# EAGLE design tdt_rereference (EAGLE 8.1.0)
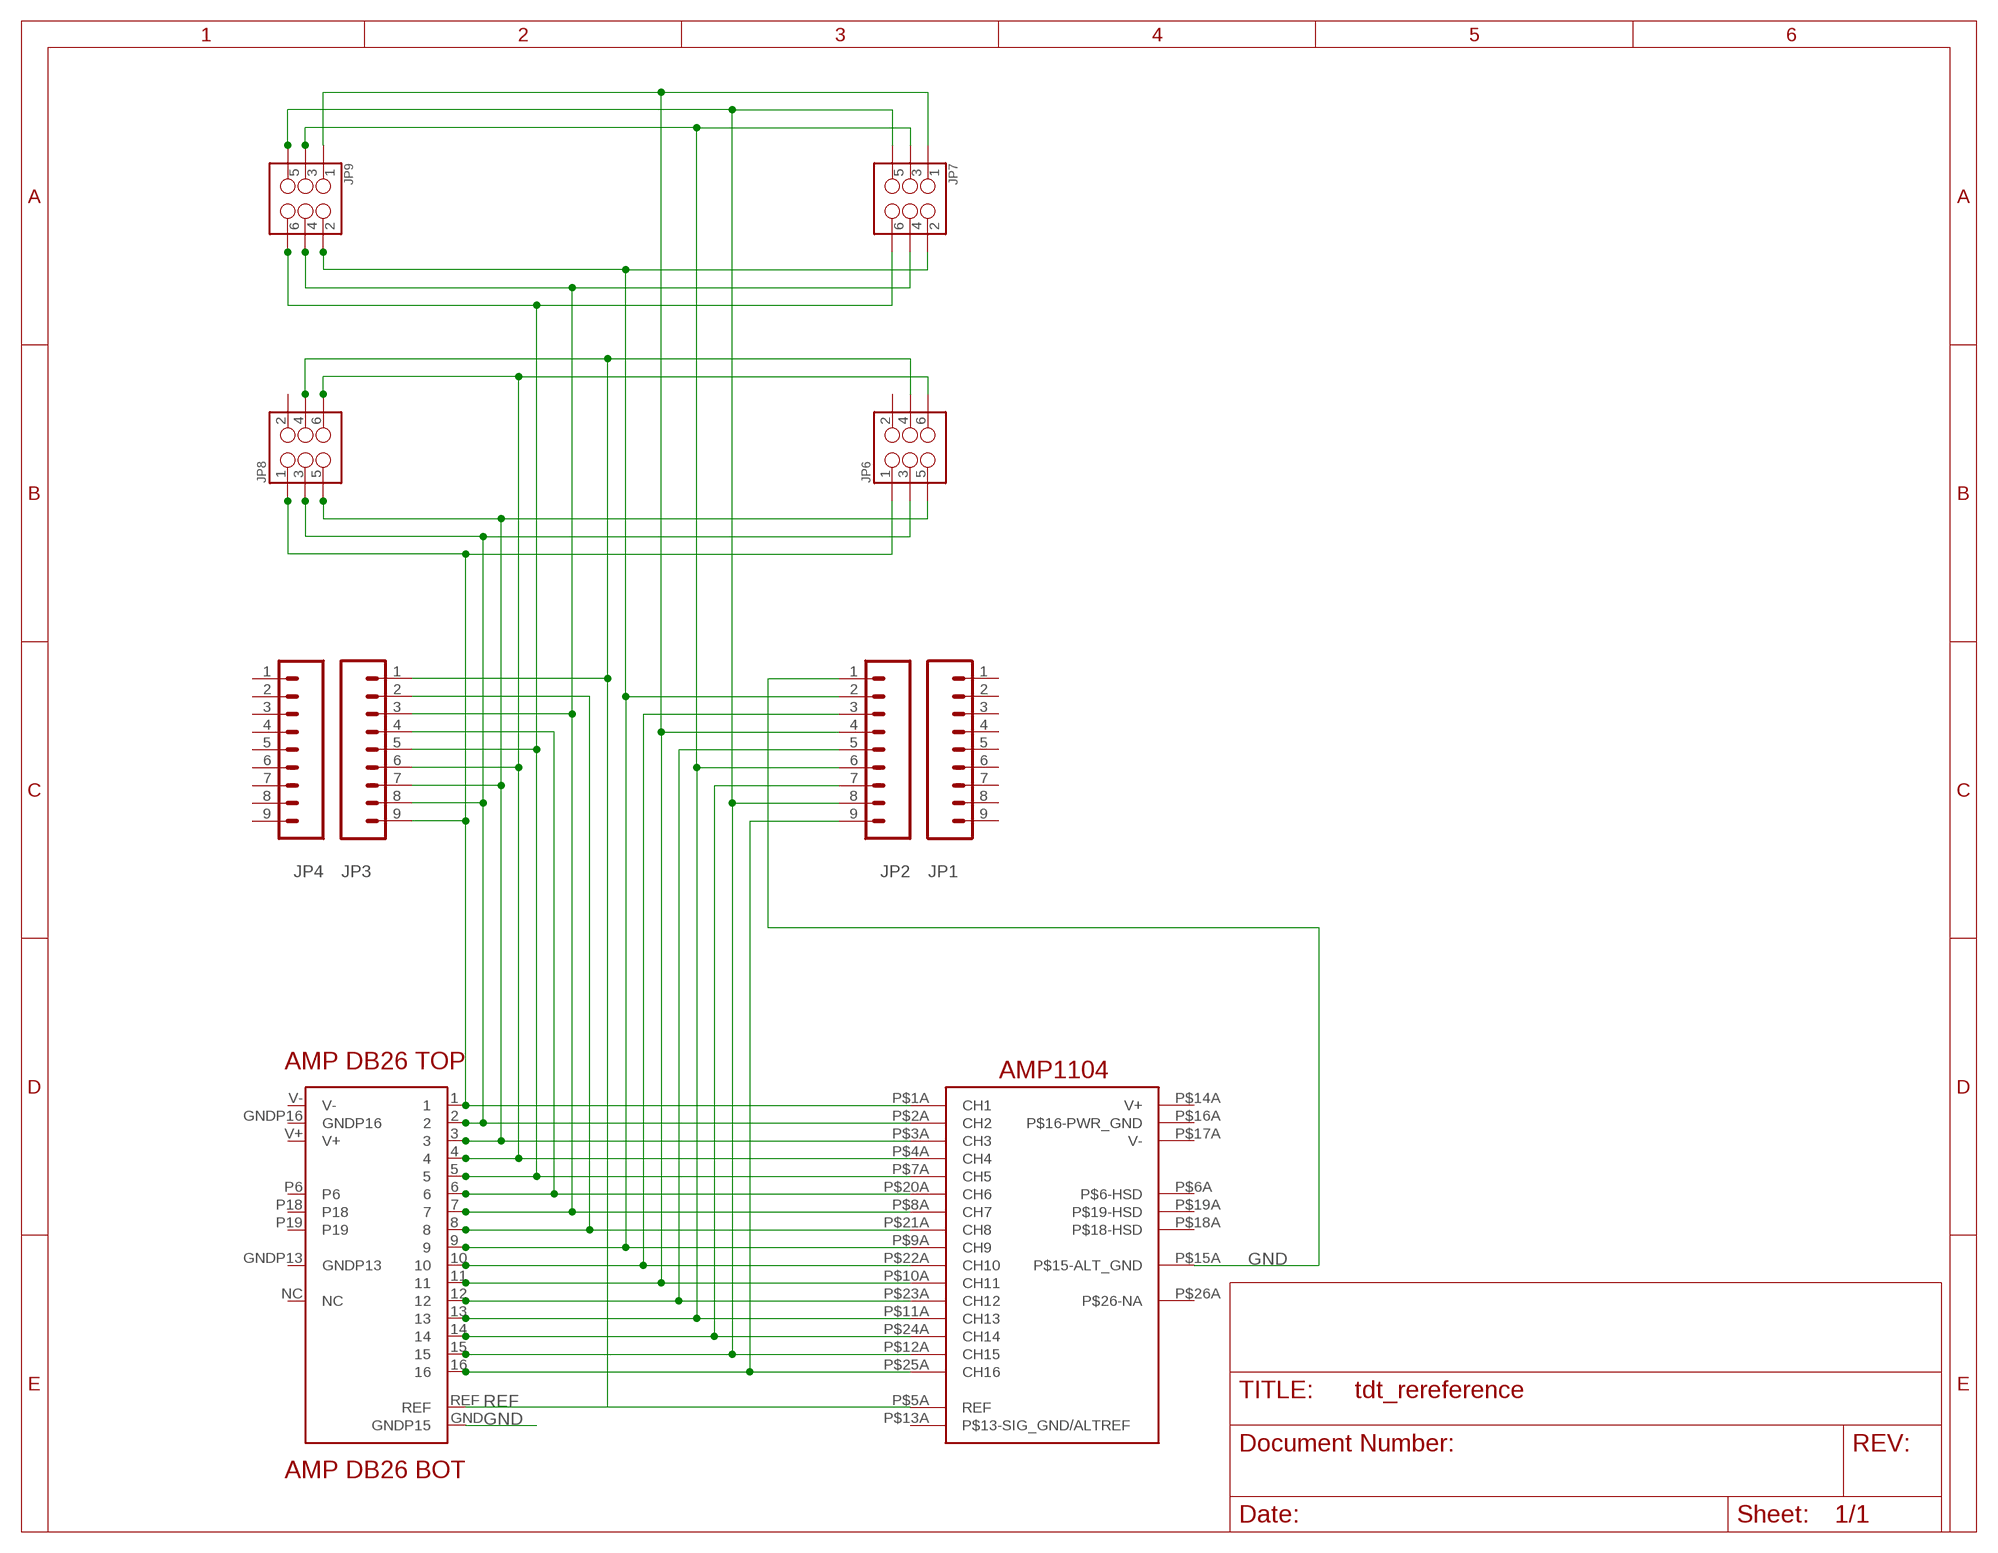
[diagram p0: schematic, sheet 1]

## Parts
JP1  M09  [1X09]
JP2  M09  [1X09]
JP3  M09  [1X09]
JP4  M09  [1X09]
JP6  M03X22X3_SILK_MALE_PTH  [2X3]
JP7  M03X22X3_SILK_MALE_PTH  [2X3]
JP8  M03X22X3_SILK_MALE_PTH  [2X3]
JP9  M03X22X3_SILK_MALE_PTH  [2X3]
U$1  DB26-MALE-BOT  [DB26-MALE-BOT]
U$2  DB26-MALE-TOP  [DB26-MALE-TOP]
U$3  AMP1104  [AMP1104]

## Nets
GND: JP2.1 U$1.GND(GNDP15) U$3.P$15A(P$15-ALT_GND)
N$1: JP3.9 JP6.1 JP8.1 U$2.1 U$3.P$1A(CH1)
N$2: JP3.8 JP6.3 JP8.3 U$2.2 U$3.P$2A(CH2)
N$3: JP3.7 JP6.5 JP8.5 U$2.3 U$3.P$3A(CH3)
N$4: JP3.6 JP6.6 JP8.6 U$2.4 U$3.P$4A(CH4)
N$5: JP3.5 JP7.6 JP9.6 U$2.5 U$3.P$7A(CH5)
N$6: JP3.4 U$1.6 U$3.P$20A(CH6)
N$7: JP3.3 JP7.4 JP9.4 U$2.7 U$3.P$8A(CH7)
N$8: JP3.2 U$1.8 U$3.P$21A(CH8)
N$9: JP2.2 JP7.2 JP9.2 U$2.9 U$3.P$9A(CH9)
N$11: JP2.4 JP7.1 JP9.1 U$2.11 U$3.P$10A(CH11)
N$12: JP2.5 U$1.12 U$3.P$23A(CH12)
N$13: JP2.6 JP7.3 JP9.3 U$2.13 U$3.P$11A(CH13)
N$14: JP2.7 U$1.14 U$3.P$24A(CH14)
N$15: JP2.8 JP7.5 JP9.5 U$2.15 U$3.P$12A(CH15)
N$16: JP2.9 U$1.16 U$3.P$25A(CH16)
N$17: JP2.3 U$1.10 U$3.P$22A(CH10)
REF: JP3.1 JP6.4 JP8.4 U$2.REF U$3.P$5A(REF)
Unconnected: JP1.1 JP1.2 JP1.3 JP1.4 JP1.5 JP1.6 JP1.7 JP1.8 JP1.9 JP4.1 JP4.2 JP4.3 JP4.4 JP4.5 JP4.6 JP4.7 JP4.8 JP4.9 JP6.2 JP8.2 U$1.GNDP16 U$1.NC U$1.P18 U$1.P19 U$1.V+ U$1.V- U$2.GNDP13 U$2.P6 U$3.P$6A(P$6-HSD) U$3.P$13A(P$13-SIG_GND/ALTREF) U$3.P$14A(V+) U$3.P$16A(P$16-PWR_GND) U$3.P$17A(V-) U$3.P$18A(P$18-HSD) U$3.P$19A(P$19-HSD) U$3.P$26A(P$26-NA)

## Library data of the parts
JP1-JP4 = SparkFun-Connectors:M09: Header 9 Standard 9-pin 0.1" header. Use with straight break away headers (SKU : PRT-00116), right angle break away headers (PRT-00553), swiss pins (PRT-00743), machine pins (PRT-00117), and female headers (PRT-00115).
JP6-JP9 = SparkFun-Connectors:M03X2: 2x3 .1" header. Shrouded, with keying- CONN-10681 SMT- CONN-11415 Pogo pins- HW-11044; PROD_ID: CONN-09701
U$1 = HDMI-DB26:DB26-MALE-BOT
U$2 = HDMI-DB26:DB26-MALE-TOP
U$3 = TDTCableConnector:AMP1104

## Board
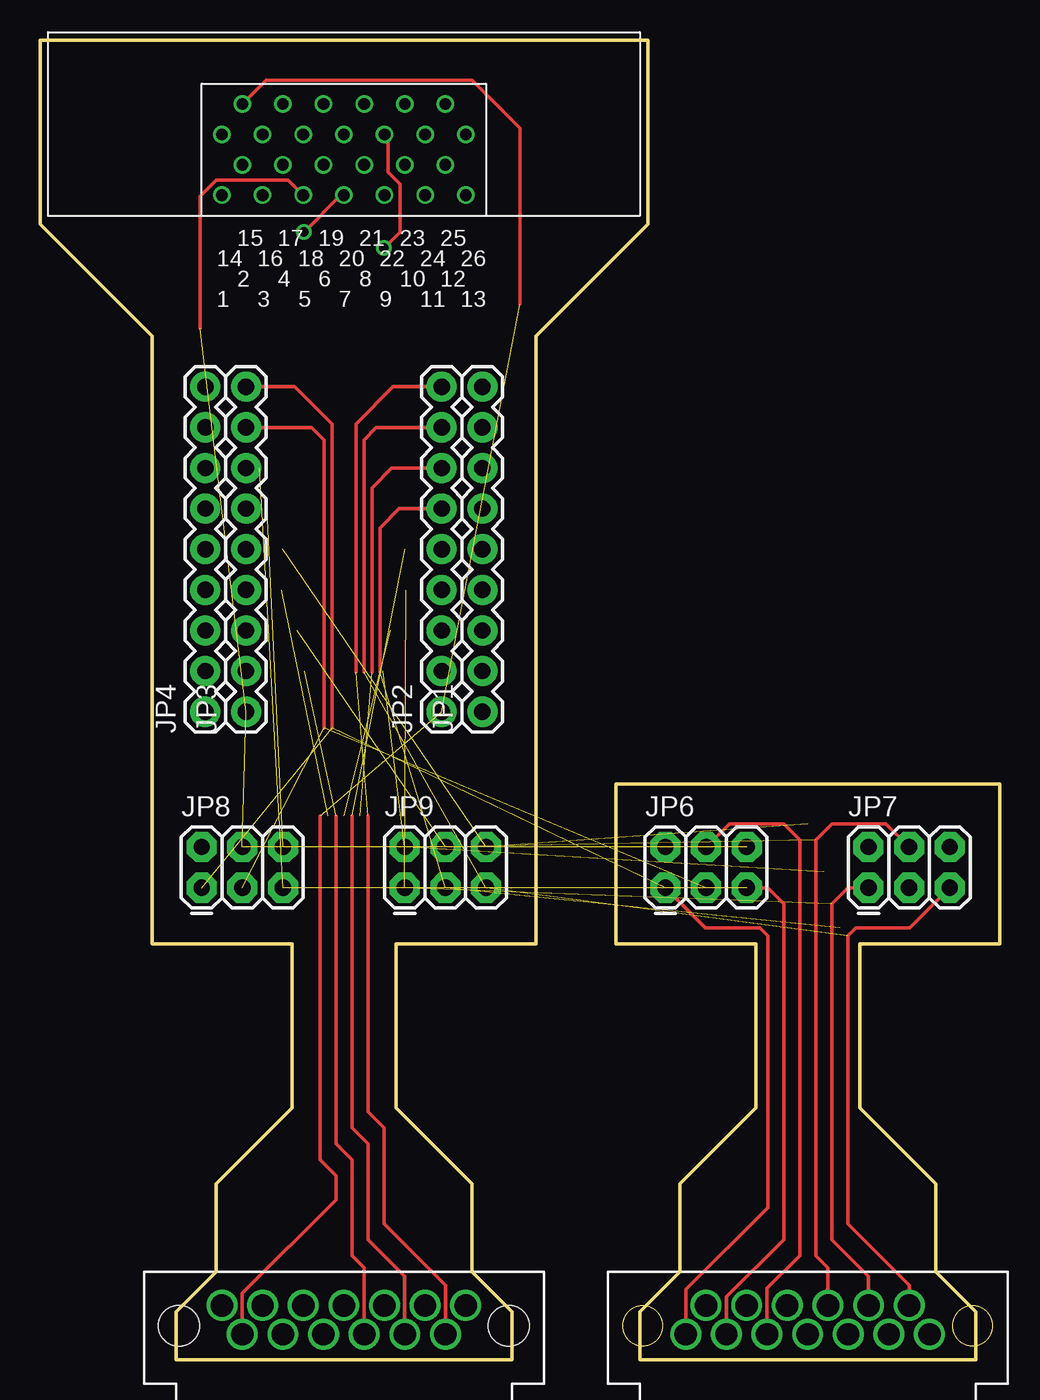
[diagram p1: board, top side]
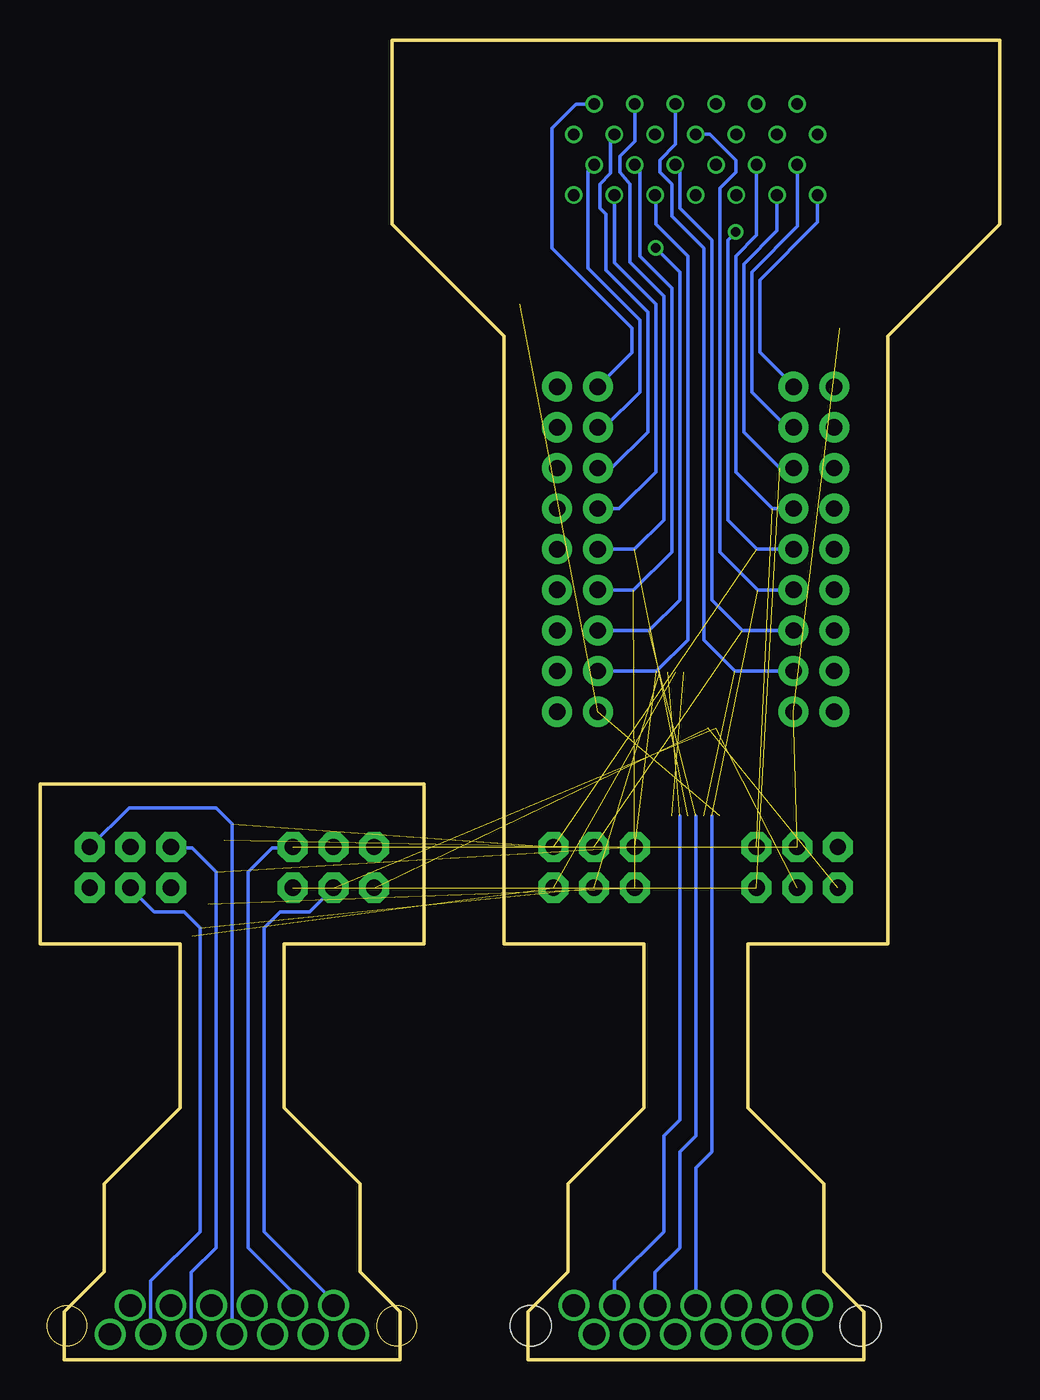
[diagram p2: board, bottom side, seen from below]

Size 60 x 82.5 mm. Coordinates in mm from the lower left corner, seen from the top.
Outline: 31,26 31,64 38,71 38,82.5 0,82.5 0,71 7,64 7,26 15.75,26 15.75,15.75 11,11 11,5.5 8.5,3 8.5,0 29.5,0 29.5,3 27,5.5 27,11 22.25,15.75 22.25,26 31,26
Outline: 58.5,0 37.5,0 37.5,3 40,5.5 40,11 44.75,15.75 44.75,26 36,26 36,36 60,36 60,26 51.25,26 51.25,15.75 56,11 56,5.5 58.5,3 58.5,0
Copper layers (1*16): Top 0.0356mm / dielectric 1.5011mm / Bottom 0.0356mm
Design rules "oshpark-2layer *": minimum track width 6mil, minimum drill 13mil, track to track 6mil, track to pad 6mil, pad to pad 6mil, via to via 6mil, smd to smd 6mil, copper to edge 15mil, drill to drill 6mil, minimum pad ring 7mil, minimum via ring 7mil, stop-mask expansion 2.5mil, vias tented up to drill 0mil, thermal gap 10mil

### Footprints (pad centres in the part's own frame; a part is rotated, then mirrored left to right if it is on the bottom)
1X09 = drill 1.016 pad 1.88: 1 0,0; 2 2.54,0; 3 5.08,0; 4 7.62,0; 5 10.16,0; 6 12.7,0; 7 15.24,0; 8 17.78,0; 9 20.32,0
2X3 = drill 1.016 pad 1.88 octagon: 1 0,0; 2 0,2.54; 3 2.54,0; 4 2.54,2.54; 5 5.08,0; 6 5.08,2.54
DB26-MALE-BOT = drill 1.4 pad 1.93: 6 0,2.12; 8 -1.27,3.92; 10 -2.54,2.12; 12 -3.81,3.92; 14 -5.08,2.12; 16 -6.35,3.92; GND 6.35,3.92; GNDP16 5.08,2.12; NC -7.62,2.12; P18 2.54,2.12; P19 1.27,3.92; V+ 7.62,2.12; V- 3.81,3.92 | hole 2.54: 10.316,3.394; -10.316,3.394
DB26-MALE-TOP = drill 1.4 pad 1.93: 1 7.62,3.92; 2 6.35,2.12; 3 5.08,3.92; 4 3.81,2.12; 5 0,3.92; 7 -1.27,2.12; 9 -2.54,3.92; 11 -3.81,2.12; 13 -5.08,3.92; 15 -6.35,2.12; GNDP13 -7.62,3.92; P6 1.27,2.12; REF 2.54,3.92
AMP1104 = drill 0.737 pad 1.092: P$1A -7.62,-5.7; P$2A -6.35,-3.8; P$3A -5.08,-5.7; P$4A -3.81,-3.8; P$5A -2.54,-5.7; P$6A -1.27,-3.8; P$7A 0,-5.7; P$8A 1.27,-3.8; P$9A 2.54,-5.7; P$10A 3.81,-3.8; P$11A 5.08,-5.7; P$12A 6.35,-3.8; P$13A 7.62,-5.7; P$14A -7.62,-1.9; P$15A -6.35,0; P$16A -5.08,-1.9; P$17A -3.81,0; P$18A -2.54,-1.9; P$19A -1.27,0; P$20A 0,-1.9; P$21A 1.27,0; P$22A 2.54,-1.9; P$23A 3.81,0; P$24A 5.08,-1.9; P$25A 6.35,0; P$26A 7.62,-1.9

### Placement (x,y rotation side)
JP1  27.66,40.5 90 top
JP2  25.12,40.5 90 top
JP3  12.88,40.5 90 top
JP4  10.34,40.5 90 top
JP6  39.11,29.5 0 top
JP7  51.81,29.5 0 top
JP8  10.11,29.5 0 top
JP9  22.81,29.5 0 top
U$1  19,5.5 180 top
U$2  48,5.5 180 top
U$3  19,78.5 0 top

### Tracks (layer width: path | path; a pad name or v marks a point on that pad's centre or on a via)
GND  (2 unrouted)
  Top 0.203: U$1.GND 12.65,4.15 18.5,10 18.5,11.5 17.5,12.5 17.5,34 | U$3.P$15A 14.15,80 27,80 30,77 30,66
N$1  (2 unrouted)
  Top 0.203: U$2.1 40.38,4.38 45.5,9.5 45.5,26.5 45,27 41.61,27 JP6.1 | JP3.9 15.93,60.82 18.25,58.5 18.25,39.5
  Bottom 0.203: JP3.9 12.82,60.82 15,63 15,67.5 11.38,71.12 U$3.P$1A
N$2  (2 unrouted)
  Top 0.203: JP3.8 16.97,58.28 17.75,57.5 17.75,39.5
  Bottom 0.203: U$2.2 41.65,3.65 46,8 46,27 45,28 43.15,28 JP6.3 | JP3.8 13.28,58.28 15.5,60.5 15.5,68 12.65,70.85 U$3.P$2A
N$3  (2 unrouted)
  Top 0.203: U$2.3 42.92,3.92 46.5,7.5 46.5,28.5 45.5,29.5 JP6.5
  Bottom 0.203: JP3.7 13.74,55.74 16,58 16,68.5 13.92,70.58 U$3.P$3A
N$4  (2 unrouted)
  Bottom 0.203: U$2.4 44.19,4.19 47,7 47,30.5 45.5,32 44.23,32 JP6.6 | JP3.6 14.2,53.2 16.5,55.5 16.5,69 15.19,70.31 U$3.P$4A
N$5  (via drill 0.6)  (2 unrouted)
  Top 0.203: U$3.P$7A 18.8,72.8 v16.5,70.5
  Bottom 0.203: JP3.5 15.16,50.66 17,52.5 17,70 v16.5,70.5 | JP7.6 54.43,34.5 49,34.5 48,33.5 U$2.5
N$6  (1 unrouted)
  Bottom 0.203: JP3.4 15.12,48.12 17.5,50.5 17.5,73.25 16.5,74.25 16.5,75 18.1,76.6 U$3.P$20A | 18,34 18,13 19,12 U$1.6
N$7  (2 unrouted)
  Top 0.203: U$2.7 49.27,5.73 48.5,6.5 48.5,32.5 49.5,33.5 52.89,33.5 JP7.4
  Bottom 0.203: JP3.3 16.08,45.58 18,47.5 18,70 20,72 20,74.43 U$3.P$8A
N$8  (1 unrouted)
  Top 0.203: U$1.8 20.27,5.73 19.5,6.5 19.5,12.5 18.5,13.5 18.5,34
  Bottom 0.203: JP3.2 16.54,43.04 18.5,45 18.5,69.5 20.5,71.5 20.5,73.5 21.25,74.25 21.25,75 20.27,75.98 U$3.P$21A
N$9  (2 unrouted)
  Bottom 0.203: U$2.9 50.54,5.46 49,7 49,30.5 50.5,32 51.77,32 JP7.2 | JP2.2 21.46,43.04 19.5,45 19.5,69 21.5,71 21.5,72.76 U$3.P$9A
N$11  (2 unrouted)
  Top 0.203: U$2.11 51.81,5.19 49.5,7.5 49.5,28.5 50.5,29.5 JP7.1
  Bottom 0.203: JP2.4 22.88,48.12 20.5,50.5 20.5,67 22.5,69 22.5,74.39 U$3.P$10A
N$12  (1 unrouted)
  Top 0.203: U$1.12 22.81,5.19 20.5,7.5 20.5,13.5 19.5,14.5 19.5,34
  Bottom 0.203: JP2.5 22.84,50.66 21,52.5 21,66.5 23.12,68.62 23.12,73.5 23.72,74.22 23.72,75.25 22.81,76.16 U$3.P$23A
N$13  (2 unrouted)
  Top 0.203: JP2.6 22.45,53.2 21.25,52 21.25,43
  Bottom 0.203: U$2.13 53.08,4.92 50,8 50,27 51,28 52.85,28 JP7.3 | JP2.6 23.8,53.2 21.5,55.5 21.5,66 24.08,68.58 U$3.P$11A
N$14  (1 unrouted)
  Top 0.203: JP2.7 21.99,55.74 20.75,54.5 20.75,43
  Bottom 0.203: U$1.14 24.08,4.92 21,8 21,14 20,15 20,34 | JP2.7 24.26,55.74 22,58 22,65.5 24.62,68.12 24.62,71.62 25,72 25,73.5 24.33,74.17 24.33,76.4 24.08,76.65 U$3.P$24A
N$15  (2 unrouted)
  Top 0.203: U$2.15 54.35,4.65 50.5,8.5 50.5,26.5 51,27 54.39,27 JP7.5 | JP2.8 21.03,58.28 20.25,57.5 20.25,43
  Bottom 0.203: JP2.8 24.72,58.28 22.5,60.5 22.5,65 25.75,68.25 25.75,74.3 U$3.P$12A
N$16  (1 unrouted)
  Top 0.203: U$1.16 25.35,4.65 21.5,8.5 21.5,14.5 20.5,15.5 20.5,34 | JP2.9 22.07,60.82 19.75,58.5 19.75,43
  Bottom 0.203: U$3.P$25A 26.5,78.5 28,77 28,69.5 23,64.5 23,62.94 JP2.9
N$17  (via drill 0.6)  (1 unrouted)
  Top 0.203: U$3.P$22A 21.75,76.39 21.75,74.25 22.5,73.5 22.5,70.5 v21.5,69.5
  Bottom 0.203: U$1.10 21.54,5.46 20,7 20,13 19,14 19,34 | JP2.3 21.92,45.58 20,47.5 20,68 v21.5,69.5
REF  (3 unrouted)
  Top 0.203: U$2.REF 45.46,4.46 47.5,6.5 47.5,32.5 46.5,33.5 43.11,33.5 JP6.4 | U$3.P$5A 15.51,73.75 11,73.75 10,72.75 10,64.5